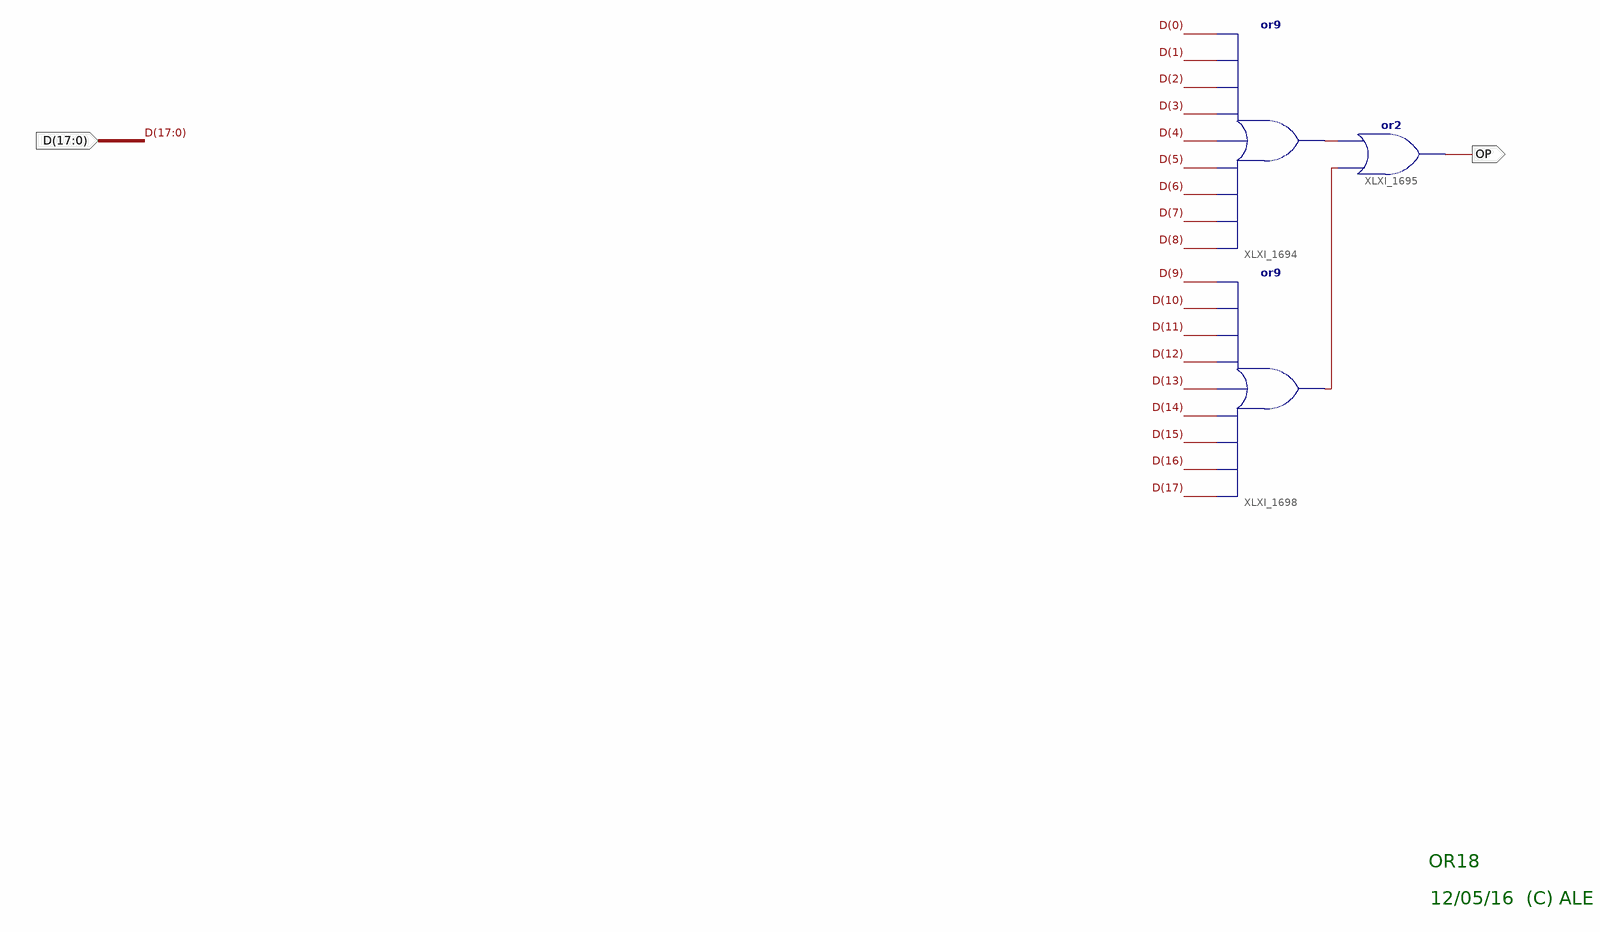
[diagram p0: schematic sheet 1]
// Xilinx ISE schematic DB_Or18.sch (spartan3e) as structural Verilog: 3 symbols, 2 ports
module DB_Or18 (
  input  [17:0] D,
  output OP
);

  wire XLXN_2350, XLXN_2415;

  or XLXI_1694 (XLXN_2350, D[8], D[7], D[6], D[5], D[4], D[3], D[2], D[1], D[0]);
  or XLXI_1698 (XLXN_2415, D[17], D[16], D[15], D[14], D[13], D[12], D[11], D[10], D[9]);
  or XLXI_1695 (OP, XLXN_2415, XLXN_2350);

  // Notes on the sheet:
  //   OR18
  //   12/05/16  (C) ALE
endmodule
